# Altium schematic sheet 9vpwr.SchDoc
size A
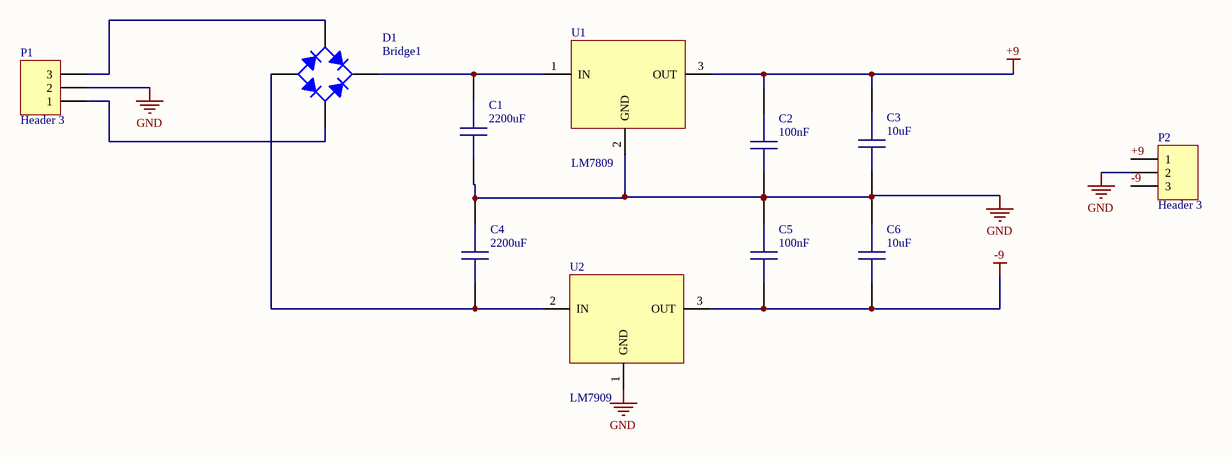
[diagram p0: 9vpwr.SchDoc]

## Parts
C1  2200uF  [Cap NP]
C2  100nF  [Cap NP]
C3  10uF  [Cap NP]
C4  2200uF  [Cap NP]
C5  100nF  [Cap NP]
C6  10uF  [Cap NP]
D1  Bridge1  [D-38]
P1  Header 3  [HDR1X3]
P2  Header 3  [HDR1X3]
U1  LM7809  [TIP 31]
U2  LM7909  [TIP 31]

## Nets
+9: C2.2 C3.2 P2.1 U1.3(OUT)
-9: C5.1 C6.1 P2.3 U2.3(OUT)
GND: C1.1 C2.1 C3.1 C4.2 C5.2 C6.2 P1.2 P2.2 U1.2(GND) U2.1(GND)
NetC1_2: C1.2 D1.1(K) U1.1(IN)
NetC4_1: C4.1 D1.3(A) U2.2(IN)
NetD1_2: D1.2(C) P1.1
NetD1_4: D1.4(C) P1.3

## Library data of the parts
C1-C6 = Cap_NP: Value: *
D1 = Bridge1: Full Wave Diode Bridge; Published: 8-Jun-2000; LatestRevisionDate: 29-May-2009; LatestRevisionNote: Sch pins A & K swapped.; DatasheetVersion: E2732B; PackageReference: D-38; Publisher: Altium Limited; PackageDescription: Bridge Rectifier; 4 Terminals; Body 9.4 x 9.4 mm (typ); Pitch 5.08 mm
P1 P2 = Header 3: Header, 3-Pin; LatestRevisionDate: 17-Jul-2002; LatestRevisionNote: Re-released for DXP Platform.; Publisher: Altium Limited